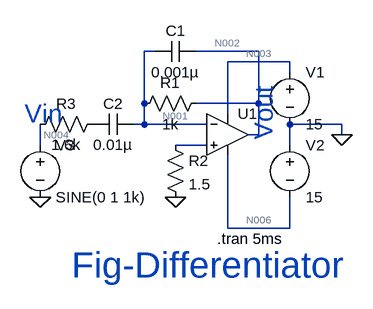
[diagram p0: schematic p-2.asc]
p-2.asc, the LTspice schematic file:
Version 4
SHEET 1 880 680
WIRE 96 112 80 112
WIRE 256 112 160 112
WIRE 304 128 208 128
WIRE 304 144 304 128
WIRE 80 192 80 112
WIRE 256 192 256 112
WIRE 256 192 160 192
WIRE 208 208 208 128
WIRE 80 224 80 192
WIRE 80 224 64 224
WIRE 176 224 80 224
WIRE 384 224 304 224
WIRE 256 240 256 192
WIRE 256 240 240 240
WIRE 384 240 384 224
WIRE -80 256 -80 224
WIRE 176 256 128 256
WIRE 304 256 304 224
WIRE 208 384 208 272
WIRE 304 384 304 336
WIRE 304 384 208 384
FLAG 384 240 0
FLAG -80 336 0
FLAG 128 336 0
SYMBOL voltage 304 128 R0
SYMATTR InstName V1
SYMATTR Value 15
SYMBOL voltage 304 240 R0
SYMATTR InstName V2
SYMATTR Value 15
SYMBOL voltage -80 240 R0
WINDOW 123 0 0 Left 0
WINDOW 39 0 0 Left 0
SYMATTR InstName V3
SYMATTR Value SINE(0 1 1k)
SYMBOL res 176 176 R90
WINDOW 0 0 56 VBottom 2
WINDOW 3 32 56 VTop 2
SYMATTR InstName R1
SYMATTR Value 1k
SYMBOL res 112 240 R0
SYMATTR InstName R2
SYMATTR Value 1.5
SYMBOL res 16 208 R90
WINDOW 0 0 56 VBottom 2
WINDOW 3 32 56 VTop 2
SYMATTR InstName R3
SYMATTR Value 1.6k
SYMBOL cap 160 96 R90
WINDOW 0 0 32 VBottom 2
WINDOW 3 32 32 VTop 2
SYMATTR InstName C1
SYMATTR Value 0.001µ
SYMBOL cap 64 208 R90
WINDOW 0 0 32 VBottom 2
WINDOW 3 32 32 VTop 2
SYMATTR InstName C2
SYMATTR Value 0.01µ
SYMBOL OpAmps\\UniversalOpAmp 208 240 R0
SYMATTR InstName U1
TEXT 192 400 Left 2 !.tran 5ms
TEXT -104 208 Left 4 ;Vin
TEXT 264 248 VLeft 4 ;Vout
TEXT -32 440 Left 5 ;Fig-Differentiator

The netlist it stands for:
* p-2.asc
V1 N003 0 15
V2 0 N006 15
V3 N004 0 SINE(0 1 1k)
R1 N002 N001 1k
R2 N005 0 1.5
R3 P001 N004 1.6k
C1 N002 N001 0.001µ
C2 N001 P001 0.01µ
XU1 N005 N001 N003 N006 N002 level1 Avol=1Meg GBW=10Meg Vos=0 En=0 Enk=0 In=0 Ink=0 Rin=500Meg  ; pins In+ In- V+ V- OUT
.tran 5ms
* Vin
* Vout
* Fig-Differentiator
.lib UniversalOpAmp1.lib
.backanno
.end

* Results of the author's LTspice run, read from the files saved beside the schematic
* Operating Point, zero values left out:
*   V(n003) = 15 V
*   V(n006) = -15 V
*   I(V1) = -30 nA
*   I(V2) = -30 nA
*   Ix(u1:3) = 30 nA
*   Ix(u1:4) = -30 nA
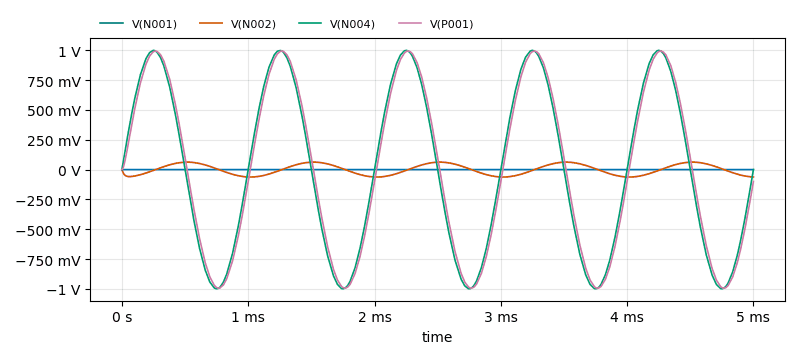
[diagram p1: Transient Analysis of p-2.asc, plotted from the saved traces]
* Transient Analysis, 1 run:
*   V(N001): min -6.251 µV, max 51.3 µV, average 199.8 nV, rms 5.04 µV, last 727.1 nV
*   V(N002): min -62.5 mV, max 62.49 mV, average 206.6 µV, rms 43.98 mV, last -62.17 mV
*   V(N004): min -999.9 mV, max 1 V, average 30.09 µV, rms 706.9 mV, last 0 V
*   V(P001): min -994.7 mV, max 994.7 mV, average 340.2 µV, rms 703.3 mV, last -99.53 mV